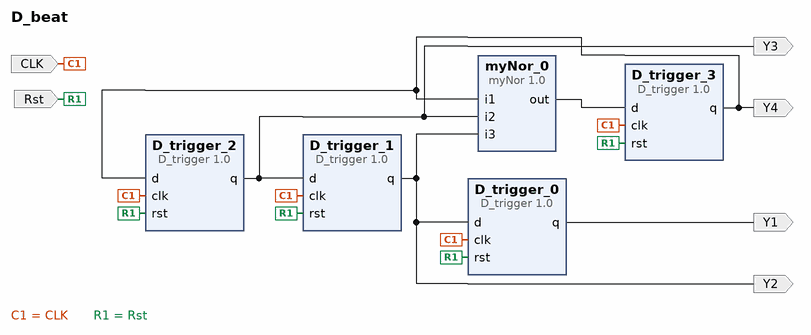
[diagram p0: block diagram of the top level]
# Vivado block design D_beat, xc7a35tcsg324-3, Vivado 2021.1
create_bd_design D_beat

create_bd_port -dir I CLK
create_bd_port -dir I Rst
create_bd_port -dir O Y4
create_bd_port -dir O Y3
create_bd_port -dir O Y2
create_bd_port -dir O Y1

create_bd_cell -type ip -vlnv xilinx.com:user:D_trigger:1.0 D_trigger_0
create_bd_cell -type ip -vlnv xilinx.com:user:D_trigger:1.0 D_trigger_1
create_bd_cell -type ip -vlnv xilinx.com:user:D_trigger:1.0 D_trigger_2
create_bd_cell -type ip -vlnv xilinx.com:user:D_trigger:1.0 D_trigger_3
create_bd_cell -type ip -vlnv xilinx.com:user:myNor:1.0 myNor_0

# ---- connections ----

connect_bd_net [get_bd_ports CLK] \
  [get_bd_pins D_trigger_0/clk] [get_bd_pins D_trigger_1/clk] [get_bd_pins D_trigger_2/clk] [get_bd_pins D_trigger_3/clk]
connect_bd_net [get_bd_pins D_trigger_0/q] [get_bd_ports Y1]
connect_bd_net [get_bd_pins D_trigger_1/q] [get_bd_pins D_trigger_0/d] [get_bd_ports Y2] [get_bd_pins myNor_0/i3]
connect_bd_net [get_bd_pins D_trigger_2/q] [get_bd_pins D_trigger_1/d] [get_bd_ports Y3] [get_bd_pins myNor_0/i2]
connect_bd_net [get_bd_pins D_trigger_3/q] [get_bd_pins D_trigger_2/d] [get_bd_ports Y4] [get_bd_pins myNor_0/i1]
connect_bd_net [get_bd_ports Rst] \
  [get_bd_pins D_trigger_0/rst] [get_bd_pins D_trigger_1/rst] [get_bd_pins D_trigger_2/rst] [get_bd_pins D_trigger_3/rst]
connect_bd_net [get_bd_pins myNor_0/out] [get_bd_pins D_trigger_3/d]

validate_bd_design
save_bd_design
